# EAGLE design controller (EAGLE 9.2.2)
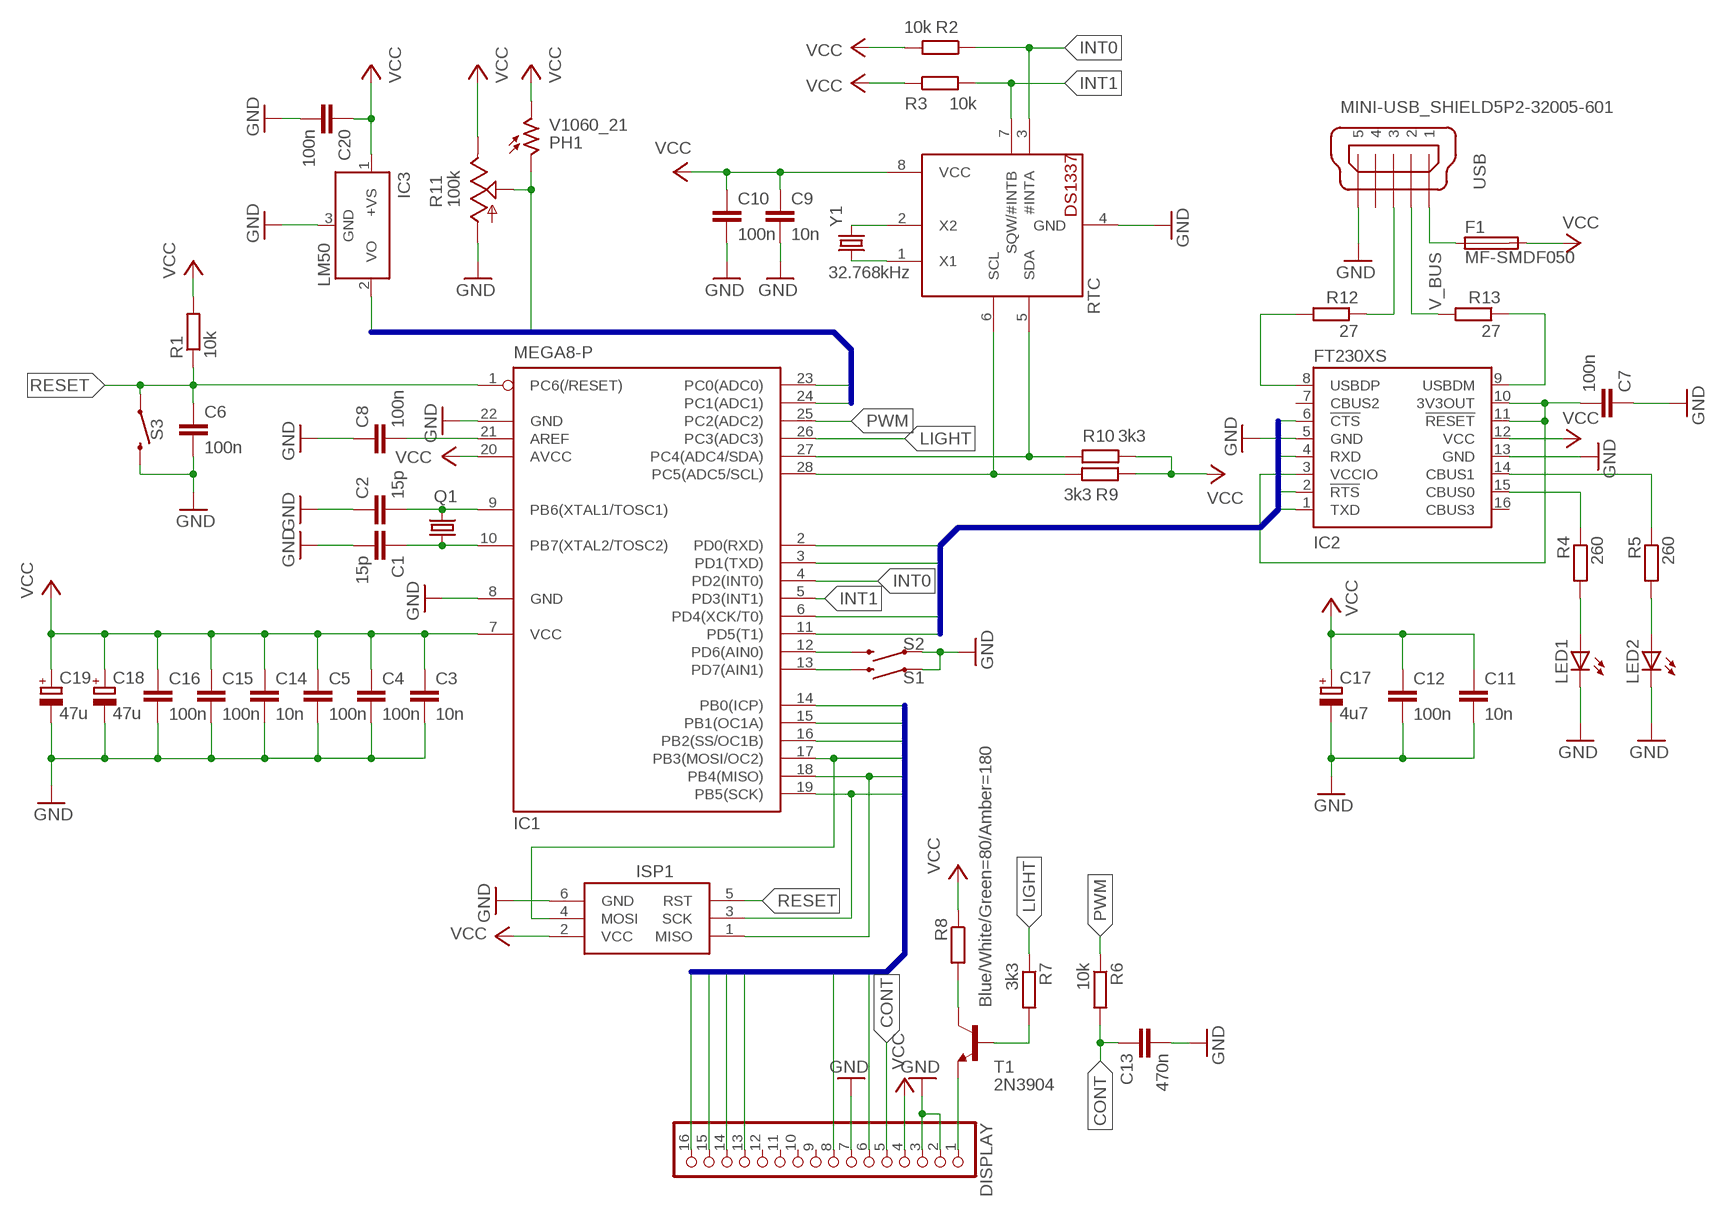
[diagram p0: schematic, sheet 1]

## Parts
C1  15p  C-EU025-024X044  [C025-024X044]
C2  15p  C-EU025-024X044  [C025-024X044]
C3  10n  C-EU025-024X044  [C025-024X044]
C4  100n  C-EU025-024X044  [C025-024X044]
C5  100n  C-EU025-024X044  [C025-024X044]
C6  100n  C-EU025-024X044  [C025-024X044]
C7  100n  C-EU025-024X044  [C025-024X044]
C8  100n  C-EU025-024X044  [C025-024X044]
C9  10n  C-EU025-024X044  [C025-024X044]
C10  100n  C-EU025-024X044  [C025-024X044]
C11  10n  C-EU025-024X044  [C025-024X044]
C12  100n  C-EU025-024X044  [C025-024X044]
C13  470n  C-EU025-024X044  [C025-024X044]
C14  10n  C-EU025-024X044  [C025-024X044]
C15  100n  C-EU025-024X044  [C025-024X044]
C16  100n  C-EU025-024X044  [C025-024X044]
C17  4u7  CPOL-EUE1.8-4  [E1,8-4]
C18  47u  CPOL-EUE1.8-4  [E1,8-4]
C19  47u  CPOL-EUE1.8-4  [E1,8-4]
C20  100n  C-EU025-024X044  [C025-024X044]
DISPLAY  PINHD-1X16  [1X16]
F1  MF-SMDF050  [MF-SMDF050]
IC1  MEGA8-P  [DIL28-3]
IC2  FT230XS  [SSOP16]
IC3  LM50  [SOT23]
ISP1  AVRISP-6  [AVRISP]
LED1  LED_ELD260  [LED_LD260]
LED2  LED_ELD260  [LED_LD260]
PH1  V1060_21  [TO-5_V10]
Q1  CRYSTALHC18U-V  [HC18U-V]
R1  10k  R-EU_0207/10  [0207/10]
R2  10k  R-EU_0207/10  [0207/10]
R3  10k  R-EU_0207/10  [0207/10]
R4  260  R-EU_0207/10  [0207/10]
R5  260  R-EU_0207/10  [0207/10]
R6  10k  R-EU_0207/10  [0207/10]
R7  3k3  R-EU_0207/10  [0207/10]
R8  Blue/White/Green=80/Amber=180  R-EU_0207/10  [0207/10]
R9  3k3  R-EU_0207/10  [0207/10]
R10  3k3  R-EU_0207/10  [0207/10]
R11  100k  TRIM_US-CT6  [CT6]
R12  27  R-EU_R0603  [R0603]
R13  27  R-EU_R0603  [R0603]
RTC  DS1337  [DIL08-ROUND]
S1  MOMENTARY-SWITCH-SPST-PTH-6.0MM  [TACTILE_SWITCH_PTH_6.0MM]
S2  MOMENTARY-SWITCH-SPST-PTH-6.0MM  [TACTILE_SWITCH_PTH_6.0MM]
S3  MOMENTARY-SWITCH-SPST-PTH-6.0MM  [TACTILE_SWITCH_PTH_6.0MM]
T1  2N3904  [TO92]
USB  MINI-USB_SHIELD5P2-32005-601  [32005-601]
Y1  32.768kHz  CRYSTAL-32.768KHZPTH-2X6  [CRYSTAL-PTH-2X6-CYL]

## Nets
ADC0: IC1.23(PC0(ADC0)) IC3.2(VO)
ADC1: IC1.24(PC1(ADC1)) PH1.1 R11.S
CONT: C13.1 DISPLAY.5 R6.2
CTS: IC1.6(PD4(XCK/T0)) IC2.6(!CTS)
DB4: DISPLAY.13 IC1.17(PB3(MOSI/OC2)) ISP1.4(MOSI)
DB5: DISPLAY.14 IC1.16(PB2(SS/OC1B))
DB6: DISPLAY.15 IC1.15(PB1(OC1A))
DB7: DISPLAY.16 IC1.14(PB0(ICP))
E: DISPLAY.8 IC1.18(PB4(MISO)) ISP1.1(MISO)
GND: C1.2 C2.1 C3.2 C4.2 C5.2 C6.2 C7.1 C8.1 C9.2 C10.2 C11.2 C12.2 C13.2 C14.2 C15.2 C16.2 C17.- C18.- C19.- C20.2 DISPLAY.2 DISPLAY.3 DISPLAY.7 IC1.8(GND) IC1.22(GND) IC2.5(GND) IC2.13(GND) IC3.3(GND) ISP1.6(GND) LED1.K(C) LED2.K(C) R11.A RTC.4(GND) S1.1 S2.1 S3.3 USB.5
INT0: IC1.4(PD2(INT0)) R2.1 RTC.3(#INTA)
INT1: IC1.5(PD3(INT1)) R3.2 RTC.7(SQW/#INTB)
LIGHT: IC1.26(PC3(ADC3)) R7.1
N$1: C2.2 IC1.9(PB6(XTAL1/TOSC1)) Q1.2
N$2: C1.1 IC1.10(PB7(XTAL2/TOSC2)) Q1.1
N$3: R13.2 USB.2
N$4: C8.2 IC1.21(AREF)
N$5: IC2.15(CBUS0) R4.1
N$6: R12.1 USB.3
N$7: IC1.12(PD6(AIN0)) S2.3
N$8: IC1.13(PD7(AIN1)) S1.3
N$9: IC2.8(USBDP) R12.2
N$10: IC2.9(USBDM) R13.1
N$11: C7.2 IC2.3(VCCIO) IC2.10(3V3OUT) IC2.11(!RESET)
N$13: IC2.14(CBUS1) R5.1
N$14: LED1.A R4.2
N$15: LED2.A R5.2
N$16: DISPLAY.1 T1.3(E)
N$17: RTC.2(X2) Y1.1
N$18: R7.2 T1.2(B)
N$19: R8.2 T1.1(C)
N$20: IC1.28(PC5(ADC5/SCL)) R9.2 RTC.6(SCL)
N$21: IC1.27(PC4(ADC4/SDA)) R10.1 RTC.5(SDA)
N$22: RTC.1(X1) Y1.2
PWM: IC1.25(PC2(ADC2)) R6.1
RESET: C6.1 IC1.1(PC6(/RESET)) ISP1.5(RST) R1.1 S3.1
RS: DISPLAY.6 IC1.19(PB5(SCK)) ISP1.3(SCK)
RTS: IC1.11(PD5(T1)) IC2.2(!RTS)
RXD: IC1.3(PD1(TXD)) IC2.4(RXD)
TXD: IC1.2(PD0(RXD)) IC2.1(TXD)
V_BUS: F1.1 USB.1
VCC: C3.1 C4.1 C5.1 C9.1 C10.1 C11.1 C12.1 C14.1 C15.1 C16.1 C17.+ C18.+ C19.+ C20.1 DISPLAY.4 F1.2 IC1.7(VCC) IC1.20(AVCC) IC2.12(VCC) IC3.1(+VS) ISP1.2(VCC) PH1.2 R1.2 R2.2 R3.1 R8.1 R9.1 R10.2 R11.E RTC.8(VCC)
Unconnected: DISPLAY.9 DISPLAY.10 DISPLAY.11 DISPLAY.12 IC2.7(CBUS2) IC2.16(CBUS3) USB.4 USB.M1(S1) USB.M2(S2)

## Buses
DB[4..7],E,RS
CTS,RTS,RXD,TXD
ADC[0..1]

## Library data of the parts
C1-C16 C20 = rcl:C-EU: CAPACITOR, European symbol; SPICEPREFIX: C
C17-C19 = rcl:CPOL-EU: POLARIZED CAPACITOR, European symbol; SPICEPREFIX: C
DISPLAY = pinhead:PINHD-1X16: PIN HEADER
F1 = fuse:MF-SMDF: MF-SMDF Series - PRC Resettable Fuses Source: http://www.farnell.com/datasheets/716597.pdf
IC1 = atmel:MEGA8-P: MICROCONTROLLER 8 Kbytes FLASH, 1 kbytes SRAM, 512 bytes EEPROM, USART, 4-channel 10 bit ADC, 2-channel 8 bit ADC Pin compatible with Atmega48, ATMega88, ATMega168 Source: avr.lbr; OC_FARNELL: unknown; OC_NEWARK: unknown
IC2 = ftdichip:FT230X: USB to BASIC UART IC Auto generated by make-symbol-device-package-bsdl.ulp Rev. 43 Source: Data sheet <http://www.ftdichip.com/Support/Documents/DataSheets/ICs/DS_FT230X.pdf>
IC3 = linear:LM50: SOT-23 Single-Supply Centigrade Temperature Sensor Vout = (10mV/°C x Temp °C) +5mmmV Source: http://cache.national.com/ds/LM/LM50.pdf
ISP1 = adafruit:AVRISP: AVR ISP HEADER Standard 6 pin header for AVR programming
LED1 LED2 = eagle-ltspice:LED_E: LED Source: http://www.osram.convergy.de Source: www.luxeon.com Source: www.kingbright.com; SPICEMODEL: NONE; SPICEPREFIX: D; SPICETYPE: diode
PH1 = photo-elements:?1060*: Sensor Street Light control Source: http://optoelectronics.perkinelmer.com/content/Datasheets/DTS_PhotocellsB1060.pdf
Q1 = crystal:CRYSTAL: CRYSTAL; OC_FARNELL: unknown; OC_NEWARK: unknown
R1-R10 R12 R13 = rcl:R-EU_: RESISTOR, European symbol; SPICEPREFIX: R
R11 = pot:TRIM_US-: POTENTIOMETER
RTC = adafruit:DS1337: DS1337 - Maxim RTC without battery backup
S1-S3 = SparkFun-Switches:MOMENTARY-SWITCH-SPST: Momentary Switch (Pushbutton) - SPST Normally-open (NO) SPST momentary switches (buttons, pushbuttons). Variants PTH-12MM - 12mm square, through-hole Momentary Pushbutton Switch - 12mm Square <https://www.sparkfun.com/products/9190> (COM-09190) PTH-6.0MM, PTH-6.0MM-KIT - 6.0mm square, through-hole Mini Pushbutton Switch <https://www.sparkfun.com/products/97> (COM-00097) KIT package intended for soldering kit's - only one side of pads' copper is exposed. PTH-RIGHT-ANGLE-KIT - Right-angle, through-hole Right Angle Tactile Button <https://www.sparkfun.com/products/10791> - Used on SparkFun BigTime Watch Kit <https://www.sparkfun.com/products/11734> SMD-12MM - 12mm square, surface-mount Tactile Button - SMD (12mm) <https://www.sparkfun.com/products/12993> (COM-12993) Used on SparkFun PicoBoard <https://www.sparkfun.com/products/11888> SMD-4.5MM - 4.5mm Square Trackball Switch Used on SparkFun Blackberry Trackballer Breakout <https://www.sparkfun.com/products/13169> SMD-4.6MMX2.8MM - 4.60mm x 2.80mm, surface mount Used on SparkFun SAMD21 Mini Breakout <https://www.sparkfun.com/products/13664> SMD-5.2MM, SMD-5.2-REDUNDANT - 5.2mm square, surface-mount Mini Pushbutton Switch - SMD <https://www.sparkfun.com/products/8720> (COM-08720) Used on Arduino Pro Mini <https://www.sparkfun.com/products/11114> REDUNDANT package connects both switch circuits together SMD-6.0X3.5MM - 6.0 x 3.5mm, surface mount Momentary Reset Switch SMD <https://www.sparkfun.com/products/8229> (COM-08229) SMD-6.2MM-TALL - 6.2mm square, surface mount Tactile Button - SMD (6mm) <https://www.sparkfun.com/products/12992> Used on SparkFun Digital Sandbox <https://www.sparkfun.com/products/12651> SMD-RIGHT-ANGLE - Right-angle, surface mount Used on SparkFun Block for Intel® Edison - Arduino <https://www.sparkfun.com/products/13036>; PROD_ID: SWCH-08441; SF_SKU: COM-00097
T1 = transistor:2N3904: NPN TRANSISTOR
USB = con-cypressindustries:MINI-USB_SHIELD5P2-: MINI USB-B R/A DIP 5pol. Source: www.cypressindustries.com; OC_FARNELL: unknown; OC_NEWARK: unknown
Y1 = SparkFun-Clocks:CRYSTAL-32.768KHZ: 32.768kHz Crystal Frequency: 32.768kHz Frequency Stability: ±20ppm Load Capacitance: 12.5pF (PTH-2X6 & SMD-3.2X1.5), 6pF (SMD-2X6) SparkFun Products: SparkFun BigTime Watch Kit <https://www.sparkfun.com/products/11734> SparkFun nRF52832 Breakout <https://www.sparkfun.com/products/13990> SparkFun Real Time Clock Module <https://www.sparkfun.com/products/12708>; PROD_ID: XTAL-10112

## Board
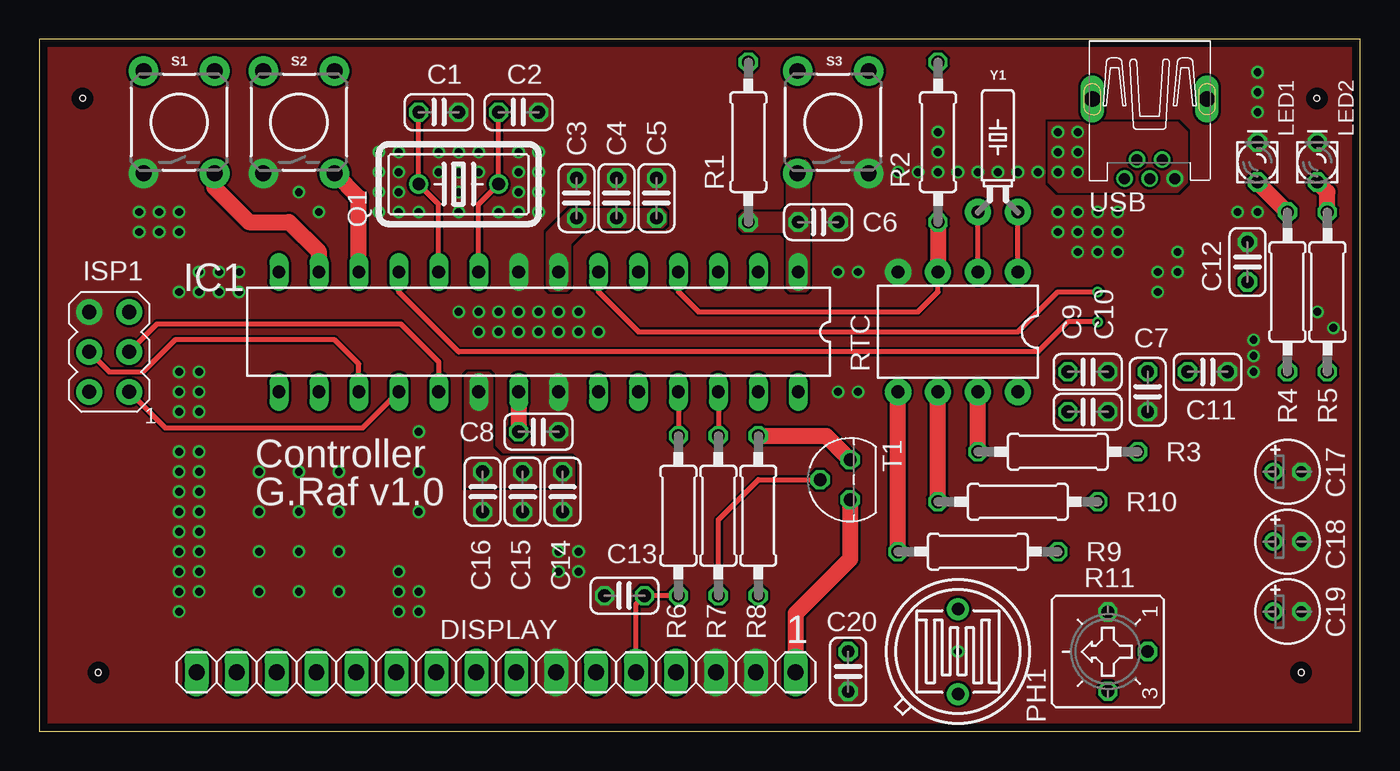
[diagram p1: board, top side]
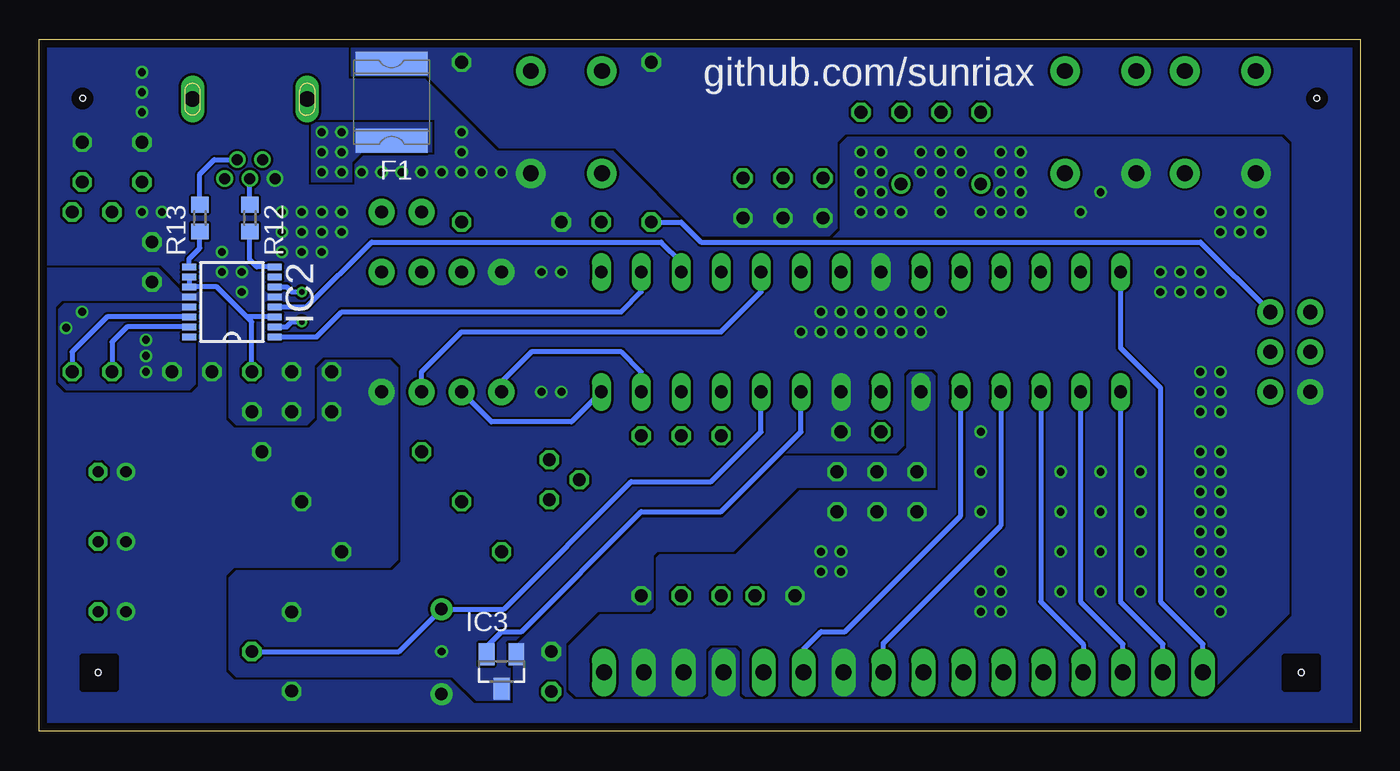
[diagram p2: board, bottom side, seen from below]

Size 84 x 44 mm. Coordinates in mm from the lower left corner, seen from the top.
Outline: 0,0 84,0 84,44 0,44 0,0
Copper layers (1*16): Top 0.035mm / dielectric 1.6mm / Bottom 0.035mm
Design rules "Elecrow_2-layer_PCB_eagle_rule": minimum track width 6mil, minimum drill 12mil, track to track 6mil, track to pad 6mil, pad to pad 6mil, via to via 8mil, smd to smd 0mil, copper to edge 20mil, drill to drill 10mil, minimum pad ring 6mil, minimum via ring 6mil, stop-mask expansion 0mil, vias tented up to drill 100mil, thermal gap 10mil
Holes 0.35 mm at 3.75,3.75 80.25,3.75 2.75,40.25 81.25,40.25
bRestrict: area 2.5,2.5 to 5,5; area 79,2.5 to 81.4,5

### Footprints (pad centres in the part's own frame; a part is rotated, then mirrored left to right if it is on the bottom)
C025-024X044 = drill 0.813 octagon: 1 -1.27,0; 2 1.27,0
E1,8-4 = drill 0.711 pad 1.168: + -0.889,0 | drill 0.711 pad 1.168 octagon: - 0.889,0
1X16 = drill 1.016 long: 1 -19.05,0; 2 -16.51,0; 3 -13.97,0; 4 -11.43,0; 5 -8.89,0; 6 -6.35,0; 7 -3.81,0; 8 -1.27,0; 9 1.27,0; 10 3.81,0; 11 6.35,0; 12 8.89,0; 13 11.43,0; 14 13.97,0; 15 16.51,0; 16 19.05,0
MF-SMDF050 = smd 1.5 x 4.6: 1 -2.45,0; 2 2.45,0
DIL28-3 = drill 0.813 long: 1 -16.51,-3.81; 2 -13.97,-3.81; 3 -11.43,-3.81; 4 -8.89,-3.81; 5 -6.35,-3.81; 6 -3.81,-3.81; 7 -1.27,-3.81; 8 1.27,-3.81; 9 3.81,-3.81; 10 6.35,-3.81; 11 8.89,-3.81; 12 11.43,-3.81; 13 13.97,-3.81; 14 16.51,-3.81; 15 16.51,3.81; 16 13.97,3.81; 17 11.43,3.81; 18 8.89,3.81; 19 6.35,3.81; 20 3.81,3.81; 21 1.27,3.81; 22 -1.27,3.81; 23 -3.81,3.81; 24 -6.35,3.81; 25 -8.89,3.81; 26 -11.43,3.81; 27 -13.97,3.81; 28 -16.51,3.81
SSOP16 = smd 0.914 x 0.406: 1 -2.718,2.223; 2 -2.718,1.587; 3 -2.718,0.953; 4 -2.718,0.318; 5 -2.718,-0.318; 6 -2.718,-0.953; 7 -2.718,-1.587; 8 -2.718,-2.223; 9 2.718,-2.223; 10 2.718,-1.587; 11 2.718,-0.953; 12 2.718,-0.318; 13 2.718,0.318; 14 2.718,0.953; 15 2.718,1.587; 16 2.718,2.223
SOT23 = smd 1 x 1.4: 1 -0.95,-1.1; 2 0.95,-1.1; 3 0,1.1
AVRISP = drill 0.9 pad 1.626: 1 -1.27,2.54; 2 1.27,2.54; 3 -1.27,0; 4 1.27,0; 5 -1.27,-2.54; 6 1.27,-2.54
LED_LD260 = drill 0.813 octagon: A -1.27,0; K 1.27,0
TO-5_V10 = drill 0.8 pad 1.4: 1 -2.7,0; 2 2.7,0
HC18U-V = drill 0.813: 1 -2.54,0; 2 2.54,0
0207/10 = drill 0.813 octagon: 1 -5.08,0; 2 5.08,0
CT6 = drill 0.813 octagon: A 2.515,0; E -2.515,0; S 0,-2.54
R0603 = smd 1 x 1.1: 1 -0.85,0; 2 0.85,0
DIL08-ROUND = drill 0.813 pad 1.676: 1 -3.81,-3.81; 2 -1.27,-3.81; 3 1.27,-3.81; 4 3.81,-3.81; 5 3.81,3.81; 6 1.27,3.81; 7 -1.27,3.81; 8 -3.81,3.81
TACTILE_SWITCH_PTH_6.0MM = drill 1.016 pad 1.88: 1 -3.251,2.261; 2 3.251,2.261; 3 -3.251,-2.261; 4 3.251,-2.261
TO92 = drill 0.813 octagon: 1 1.27,0; 2 0,1.905; 3 -1.27,0
32005-601 = drill 0.7 pad 1.016: 1 2.825,1.6; 2 1.625,0.8; 3 2.825,0; 4 1.625,-0.8; 5 2.825,-1.6 | drill 1 pad 1.422 long: M1 -2.225,3.65; M2 -2.225,-3.65
CRYSTAL-PTH-2X6-CYL = drill 0.813 pad 1.676: 1 -1.27,0; 2 1.27,0

### Placement (x,y rotation side)
C1  25.4,39.37 0 top
C2  30.48,39.37 180 top
C3  34.16,33.91 90 top
C4  36.7,33.91 90 top
C5  39.24,33.91 90 top
C6  49.53,32.38 0 top
C7  70.48,21.59 90 top
C8  31.75,19.05 180 top
C9  66.67,22.86 0 top
C10  66.67,20.32 0 top
C11  74.3,22.86 0 top
C12  76.83,29.84 90 top
C13  37.21,8.64 180 top
C14  33.27,15.24 270 top
C15  30.73,15.24 270 top
C16  28.19,15.24 270 top
C17  79.38,16.51 0 top
C18  79.38,12.06 0 top
C19  79.38,7.62 0 top
C20  51.44,3.81 270 top
DISPLAY  29.05,3.75 180 top
F1  61.59,40.01 90 bottom
IC1  31.75,25.4 180 top
IC2  71.75,27.3 180 bottom
IC3  54.61,3.81 180 bottom
ISP1  4.45,24.13 180 top
LED1  77.47,36.2 90 top
LED2  81.28,36.2 90 top
PH1  58.42,5.08 270 top
Q1  26.67,34.8 0 top
R1  45.09,37.47 90 top
R2  57.15,37.47 90 top
R3  64.77,17.78 180 top
R4  79.38,27.94 90 top
R5  81.92,27.94 90 top
R6  40.64,13.72 270 top
R7  43.18,13.72 270 top
R8  45.72,13.72 90 top
R9  62.23,14.61 180 top
R10  59.69,11.43 0 top
R11  67.94,5.08 90 top
R12  70.61,32.64 270 bottom
R13  73.79,32.64 90 bottom
RTC  58.42,25.4 180 top
S1  8.89,38.73 90 top
S2  16.51,38.73 90 top
S3  50.48,38.73 90 top
T1  51.56,16 90 top
USB  70.61,37.97 270 top
Y1  60.96,33.02 0 top

### Tracks (layer width: path | path; a pad name or v marks a point on that pad's centre or on a via)
ADC0
  Bottom 0.305: IC3.2 55.56,5.4 54.61,6.35 53.34,6.35 45.72,13.97 40.64,13.97 35.56,19.05 IC1.23
ADC1
  Bottom 0.305: R11.S 61.12,5.08 PH1.1 54.45,7.78 46.35,15.88 41.27,15.88 38.1,19.05 IC1.24
CONT
  Top 0.305: R6.2 C13.1 37.94,8.1 DISPLAY.5
CTS  (via drill 0.35)
  Top 0.305: IC1.6 35.56,27.94 38.1,25.4 62.23,25.4 64.77,27.94 v67.31,27.94
  Bottom 0.305: IC2.6 68.26,28.26 67.94,27.94 v67.31,27.94
DB4
  Top 0.305: ISP1.4 4.45,22.86 6.6,22.86 8.64,24.89 18.8,24.89 20.32,23.37 IC1.17
  Bottom 0.305: IC1.17 20.32,8.26 17.62,5.55 DISPLAY.13
DB5
  Bottom 0.305: IC1.16 17.78,8.26 15.08,5.55 DISPLAY.14
DB6
  Bottom 0.305: IC1.15 15.24,8.26 12.54,5.55 DISPLAY.15
DB7
  Bottom 0.305: IC1.14 15.24,24.38 12.7,21.84 12.7,8.26 10,5.55 DISPLAY.16
E
  Top 0.305: ISP1.1 8,19.3 20.57,19.3 IC1.18
  Bottom 0.305: IC1.18 22.86,13.08 30.32,5.62 DISPLAY.8
GND  (via drill 0.5)
  other vias: 81.28,26.67 77.22,22.86 77.22,23.88 77.22,24.89 82.3,25.65 8.89,22.86 8.89,21.59 8.89,20.32 10.16,21.59 10.16,22.86 27.94,26.67 29.21,26.67 30.48,26.67 31.75,26.67 33.02,26.67 34.29,26.67 34.29,25.4 33.02,25.4 31.75,25.4 30.48,25.4 29.21,25.4 27.94,25.4 26.67,26.67 35.56,25.4 10.16,29.21 11.43,29.21 12.7,29.21 12.7,27.94 8.89,27.94 10.16,27.94 11.43,27.94 26.67,35.56 24.13,33.02 29.21,33.02 26.67,33.02 26.67,36.83 31.75,36.83 31.75,35.56 31.75,34.29 31.75,33.02 30.48,33.02 22.86,33.02 21.59,33.02 21.59,34.29 21.59,35.56 21.59,36.83 30.48,35.56 30.48,36.83 30.48,34.29 27.94,36.83 25.4,36.83 25.4,35.56 27.94,35.56 26.67,34.29 22.86,34.29 22.86,35.56 22.86,36.83 64.77,33.02 64.77,31.75 66.04,31.75 66.04,30.48 67.31,30.48 67.31,31.75 67.31,33.02 66.04,33.02 68.58,33.02 68.58,31.75 68.58,30.48 72.39,30.48 72.39,29.21 71.12,29.21 71.12,27.94 76.2,33.02 77.47,33.02 77.47,41.91 77.47,40.64 77.47,39.37 57.15,35.56 57.15,36.83 57.15,38.1 58.42,35.56 59.69,35.56 60.96,35.56 62.23,35.56 63.5,35.56 55.88,35.56 54.61,35.56 52.07,29.21 50.8,29.21 6.35,33.02 7.62,33.02 8.89,33.02 8.89,31.75 7.62,31.75 6.35,31.75 16.51,34.29 17.78,33.02 10.16,20.32 8.89,17.78 8.89,15.24 8.89,12.7 8.89,10.16 8.89,7.62 10.16,10.16 10.16,12.7 10.16,15.24 10.16,17.78 8.89,16.51 10.16,16.51 10.16,13.97 8.89,13.97 8.89,11.43 10.16,11.43 8.89,8.89 10.16,8.89 22.86,10.16 22.86,8.89 22.86,7.62 24.13,7.62 24.13,8.89 19.05,8.89 16.51,8.89 13.97,8.89 13.97,11.43 13.97,13.97 13.97,16.51 16.51,11.43 16.51,13.97 16.51,16.51 19.05,11.43 19.05,13.97 19.05,16.51 34.29,11.43 33.02,11.43 33.02,10.16 34.29,10.16 58.42,5.08 52.07,21.59 50.8,21.59 24.13,19.05 24.13,16.51 24.13,13.97
  pour Top (rank 2, no thermals): 0,43.94 83.95,43.94 83.95,0 0,0
  pour Bottom (rank 3, no thermals): 0,43.94 83.95,43.94 83.95,0 0,0
  pour Bottom (no thermals): 82.8,22.23 82.3,21.72 74.42,21.72 74.04,22.1 74.04,27.18 82.42,27.18 82.8,26.8
INT0
  Top 0.305: IC1.4 40.64,27.94 41.91,26.67 55.88,26.67 57.15,27.94 RTC.3
  Top 1.016: R2.1 RTC.3
INT1
  Top 1.016: R3.2 RTC.7
  Bottom 0.305: RTC.7 59.69,22.86 57.15,25.4 40.64,25.4 38.1,27.94 IC1.5
LIGHT
  Top 0.305: IC1.26 R7.1
N$1
  Top 0.305: IC1.9 27.94,33.53 Q1.2 C2.2
N$2
  Top 0.305: IC1.10 25.4,33.53 Q1.1 C1.1
N$3
  Bottom 0.305: R13.2 73.79,35.43 72.87,36.35 USB.2
N$4
  Top 1.016: IC1.21 C8.2
N$5
  Bottom 0.305: IC2.15 78.42,25.72 79.38,24.77 R4.1
N$6
  Bottom 0.305: R12.1 USB.3
N$7
  Top 1.016: S2.3 20.32,33.93 IC1.12
N$8
  Top 1.016: IC1.13 17.78,30.48 15.88,32.38 13.34,32.38 11.15,34.57 S1.3
N$9
  Bottom 0.305: IC2.8 70.17,29.53 70.61,29.97 R12.2
N$10
  Bottom 0.305: R13.1 73.79,30.72 74.47,30.04 IC2.9
N$11
  Bottom 0.305: IC2.10 IC2.11 72.71,28.26 71.12,26.67 70.8,26.35 | IC2.3 70.8,26.35 | C7.2 70.48,26.04 70.8,26.35
N$13
  Bottom 0.305: IC2.14 79.69,26.35 81.92,24.13 R5.1
N$14
  Top 1.016: R4.2 LED1.A
N$15
  Top 1.016: R5.2 81.92,34.29 LED2.A
N$16
  Top 1.016: DISPLAY.1 48.1,7.49 51.56,10.96 T1.3
N$17
  Top 0.305: RTC.2 Y1.1
N$18
  Top 0.305: R7.2 43.18,13.46 45.72,16 T1.2
N$19
  Top 1.016: R8.2 50.04,18.8 T1.1
N$20
  Top 1.016: R9.2 RTC.6
  Bottom 0.305: IC1.28 50.16,19.68 55.24,19.68 RTC.6
N$21
  Top 1.016: R10.1 RTC.5
  Bottom 0.305: IC1.27 45.72,22.86 46.99,24.13 52.7,24.13 54.61,22.23 RTC.5
N$22
  Top 0.305: RTC.1 Y1.2
PWM
  Top 0.305: IC1.25 R6.1
RESET
  Bottom 0.305: ISP1.5 10.16,31.11 41.91,31.11 43.18,32.38 R1.1
  pour Top (no thermals): 44.7,31.75 47.24,31.75 47.5,31.5 47.5,28.19 47.75,27.94 48.77,27.94 49.02,28.19 49.02,36.07 48.77,36.32 47.75,36.32 47.5,36.07 47.5,33.27 47.24,33.02 44.7,33.02 44.45,32.77 44.45,32
RS
  Top 0.305: ISP1.3 7.49,25.91 22.99,25.91 25.4,23.5 IC1.19
  Bottom 0.305: IC1.19 25.4,13.72 32.77,6.35 34.29,6.35 35.4,5.24 DISPLAY.6
RTS  (via drill 0.35)
  Top 0.305: v67.31,26.04 65.41,26.04 63.5,24.13 26.67,24.13 22.86,27.94 IC1.11
  Bottom 0.305: IC2.2 68.26,25.72 67.94,26.04 v67.31,26.04
RXD
  Bottom 0.305: IC2.4 66.99,26.99 62.87,31.11 44.45,31.11 43.18,29.84 IC1.3
TXD
  Bottom 0.305: IC2.1 66.36,25.08 64.77,26.67 46.99,26.67 45.72,27.94 IC1.2
V_BUS  (via drill 0.5)
  other vias: 64.77,38.1 64.77,36.83 64.77,35.56 66.04,35.56 66.04,36.83 66.04,38.1
  pour Top (no thermals): 64.77,34.29 72.39,34.29 73.03,34.92 73.03,38.1 72.39,38.73 64.14,38.73 64.14,34.92
  pour Bottom (no thermals): 59.05,38.73 59.05,36.83 63.5,36.83 64.14,36.2 64.14,34.92 66.67,34.92 66.67,38.73
VCC
  pour Bottom (rank 2, no thermals): 64.14,43.94 0,43.94 0,0 83.95,0 83.95,29.46 76.45,29.46 74.93,27.94 72.9,27.94 72.14,27.18 72.14,19.81 71.63,19.3 66.8,19.3 66.29,19.81 66.29,23.11 65.79,23.62 61.72,23.62 61.21,23.11 61.21,10.92 61.72,10.41 71.63,10.41 72.14,9.91 72.14,3.81 71.63,3.3 57.91,3.3 56.39,1.78 53.85,1.78 53.85,5.59 53.59,5.59 45.59,13.59 40.51,13.59 36.58,17.53 29.34,17.53 28.83,18.03 28.83,22.61 28.57,22.86 27.3,22.86 27.05,22.61 27.05,15.49 35.81,15.49 39.88,11.43 44.7,11.43 44.96,11.18 44.96,7.87 45.21,7.62 48.51,7.62 50.55,5.59 50.55,2.54 50.04,2.03 41.66,2.03 41.4,2.29 41.4,5.08 41.15,5.33 39.75,5.33 39.5,5.08 39.5,2.29 39.24,2.03 9.65,2.03 4.32,7.37 4.32,37.47 4.83,37.97 32.77,37.97 33.27,37.47 33.27,32 33.78,31.5 41.78,31.5 47.37,37.08 54.74,37.08 59.31,41.66 64.14,41.66
  pour Top (no thermals): 33.78,28.45 33.78,28.19 33.53,27.94 32.51,27.94 32.26,28.19 32.26,31.75 33.78,33.27 39.62,33.27 39.88,33.02 39.88,32.38 39.88,32.26 39.62,32 34.8,32 33.78,30.99
  pour Top (no thermals): 27.05,15.49 27.05,22.61 27.3,22.86 28.57,22.86 28.83,22.61 28.83,18.03 29.34,17.53 33.78,17.53 34.04,17.27 34.04,15.75 33.78,15.49

### Text on the board
tNames: Controller | G.Raf v1.0 | 1
bNames: github.com/sunriax